# EAGLE design usb-dmx-ftdi (EAGLE 5.11)
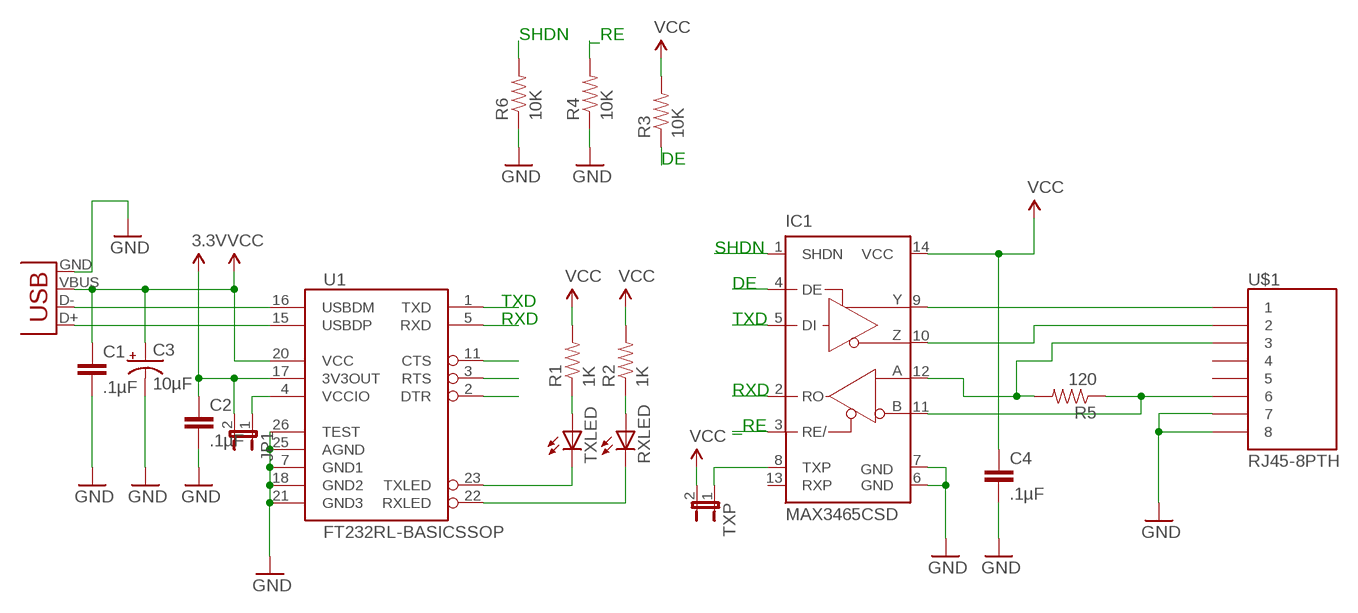
[diagram p0: schematic, sheet 1]

## Parts
C1  .1µF  CAP1206  [1206]
C2  .1µF  CAP1206  [1206]
C3  10µF  CAP_POL1206  [EIA3216]
C4  .1µF  CAP1206  [1206]
IC1  MAX3465CSD  [SO14]
JP1  JUMPER-2PTH  [1X02]
R1  1K  RESISTOR1206  [1206]
R2  1K  RESISTOR1206  [1206]
R3  10K  RESISTOR1206  [1206]
R4  10K  RESISTOR1206  [1206]
R5  120  RESISTOR1206  [1206]
R6  10K  RESISTOR1206  [1206]
RXLED  LEDCHIPLED_1206  [CHIPLED_1206]
TXLED  LEDCHIPLED_1206  [CHIPLED_1206]
TXP  JUMPER-2PTH  [1X02]
U1  FT232RL-BASICSSOP  [SSOP28DB]
U$1  RJ45-8PTH  [RJ45-8]
X1  USBSMD  [USB-MINIB]

## Nets
3.3V: C2.1 JP1.2 U1.17(3V3OUT)
DE: IC1.4(DE) R3.1
GND: C1.2 C2.2 C3.C(-) C4.2 IC1.6(GND) IC1.7(GND) R4.1 R6.1 U1.7(GND1) U1.18(GND2) U1.21(GND3) U1.25(AGND) U1.26(TEST) U$1.7 U$1.8 X1.GND
N$1: U1.16(USBDM) X1.D-
N$2: U1.15(USBDP) X1.D+
N$3: JP1.1 U1.4(VCCIO)
N$4: IC1.12(A) R5.2 U$1.3
N$5: RXLED.C U1.22(RXLED)
N$6: R1.1 TXLED.A
N$7: R2.1 RXLED.A
N$8: IC1.11(B) R5.1 U$1.6
N$9: IC1.9(Y) U$1.1
N$10: IC1.10(Z) U$1.2
N$11: U1.11(CTS)
N$12: U1.3(RTS)
N$13: U1.2(DTR)
N$14: IC1.8(TXP) TXP.1
RE/: IC1.3(RE/) R4.2
RX: TXLED.C U1.23(TXLED)
RXD: IC1.2(RO) U1.5(RXD)
SHDN: IC1.1(SHDN) R6.2
TXD: IC1.5(DI) U1.1(TXD)
VCC: C1.1 C3.A(+) C4.1 IC1.14(VCC) R1.2 R2.2 R3.2 TXP.2 U1.20(VCC) X1.VBUS
Unconnected: IC1.13(RXP) U$1.4 U$1.5

## Notes on the sheet
- SHDN | _RE
- DE
- SHDN
- DE
- TXD
- RXD | TXD
- RXD
- _RE

## Library data of the parts
C1 C2 C4 = SparkFun:CAP: Capacitor Standard 0603 ceramic capacitor, and 0.1" leaded capacitor.
C3 = SparkFun:CAP_POL: Capacitor Polarized These are standard SMD and PTH capacitors. Normally 10uF, 47uF, and 100uF in electrolytic and tantalum varieties. Always verify the external diameter of the through hole cap, it varies with capacity, voltage, and manufacturer. The EIA devices should be standard.
IC1 = maxim:MAX346*: +5V, Fail-Safe, 40Mbps, Profibus RS-485/RS-422 Transceivers Source: MAX3465-MAX3469.pdf
JP1 TXP = SparkFun:JUMPER-2: Jumper Basic 0.1" spaced jumper. Use with breakaway headers.
R1-R6 = SparkFun:RESISTOR: Resistor Basic schematic elements and footprints for 0603, 1206, and PTH resistors.
RXLED TXLED = adafruit:LED: LED OSRAM: - CHIPLED LG R971, LG N971, LY N971, LG Q971, LY Q971, LO R971, LY R971 LH N974, LH R974 LS Q976, LO Q976, LY Q976 LO Q996 - Hyper CHIPLED LW Q18S LB Q993, LB Q99A, LB R99A - SideLED LS A670, LO A670, LY A670, LG A670, LP A670 LB A673, LV A673, LT A673, LW A673 LH A674 LY A675 LS A676, LA A676, LO A676, LY A676, LW A676 LS A679, LY A679, LG A679 - Hyper Micro SIDELED® LS Y876, LA Y876, LO Y876, LY Y876 LT Y87S - SmartLED LW L88C, LW L88S LB L89C, LB L89S, LG L890 LS L89K, LO L89K, LY L89K LS L896, LA L896, LO L896, LY L896 - TOPLED LS T670, LO T670, LY T670, LG T670, LP T670 LSG T670, LSP T670, LSY T670, LOP T670, LYG T670 LG T671, LOG T671, LSG T671 LB T673, LV T673, LT T673, LW T673 LH T674 LS T676, LA T676, LO T676, LY T676, LB T676, LH T676, LSB T676, LW T676 LB T67C, LV T67C, LT T67C, LS T67K, LO T67K, LY T67K, LW E67C LS E67B, LA E67B, LO E67B, LY E67B, LB E67C, LV E67C, LT E67C LW T67C LS T679, LY T679, LG T679 LS T770, LO T770, LY T770, LG T770, LP T770 LB T773, LV T773, LT T773, LW T773 LH T774 LS E675, LA E675, LY E675, LS T675 LS T776, LA T776, LO T776, LY T776, LB T776 LHGB T686 LT T68C, LB T68C - Hyper Mini TOPLED® LB M676 - Mini TOPLED Santana® LG M470 LS M47K, LO M47K, LY M47K Source: http://www.osram.convergy.de/
U1 = SparkFun:FT232RL-BASIC: USB UART This is the simplified version of the FT232RL unit. Only what you need, nothing you don't. Spark Fun Electronics SKU : COM-00650
U$1 = SparkFun:RJ45-8: RJ45 Jack Simple RJ45, 8-pin connection - connector for common Cat5, Cat5e, and Cat6 Ethernet cables. Footprint not yet proven in production. Connector sku is PRT-00643; Breakout PCB sku is BOB-00716.
X1 = SparkFun:USB: USB Connectors USB-B-PTH is fully proven SKU : PRT-00139 USB-miniB is fully proven SKU : PRT-00587 USB-A-PCB is untested. USB-A-H is throughly reviewed, but untested. Spark Fun Electronics SKU : PRT-00437 USB-B-SMT is throughly reviewed, but untested. Needs silkscreen touching up. USB-A-S has not been used/tested USB-MB-H has not been used/tested

## Board
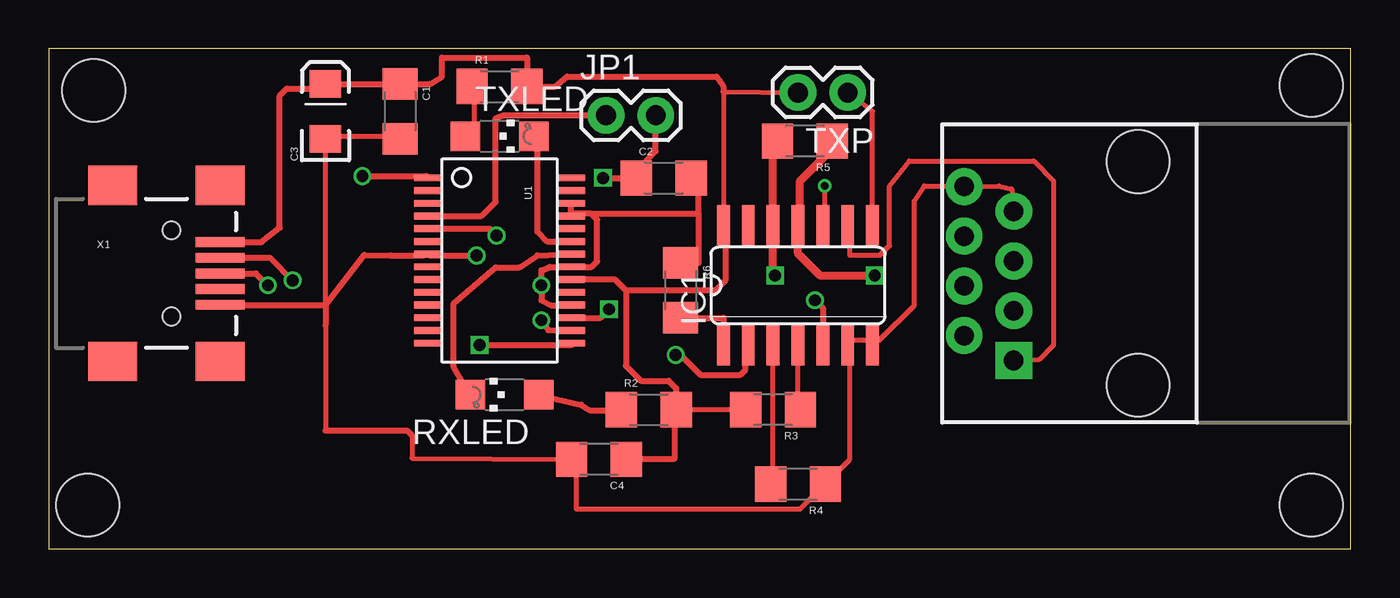
[diagram p1: board, top side]
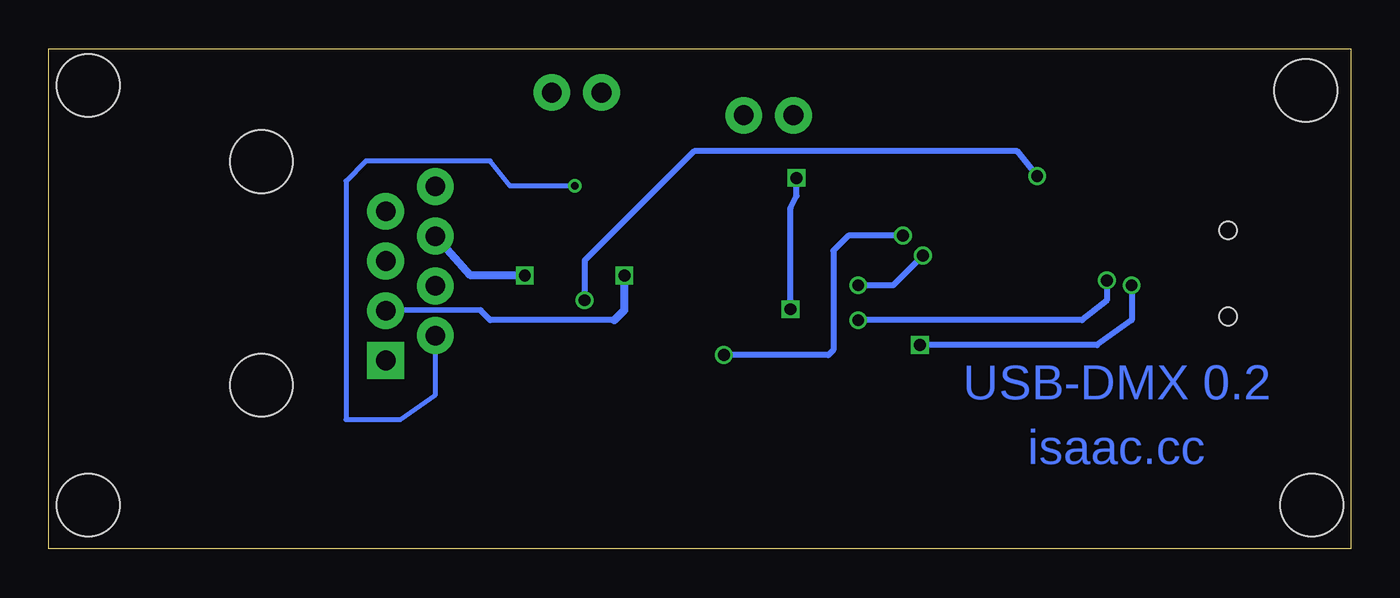
[diagram p2: board, bottom side, seen from below]

Size 66.47 x 25.54 mm. Coordinates in mm from the lower left corner, seen from the top.
Outline: 0,0 66.47,0 66.47,25.54 0,25.54 0,0
Copper layers (1*16): Top 0.035mm / dielectric 1.5mm / Bottom 0.035mm
Design rules "Fusion_eagle_rule_v1.1": minimum track width 6mil, minimum drill 12mil, track to track 6mil, track to pad 6mil, pad to pad 6mil, via to via 6mil, smd to smd 0mil, copper to edge 10mil, drill to drill 10mil, minimum pad ring 10mil, minimum via ring 6mil, stop-mask expansion 2mil, vias tented up to drill 100mil, thermal gap 10mil
Holes 3.2 mm at 1.98,2.24 2.29,23.42 64.47,23.67 64.47,2.24

### Footprints (pad centres in the part's own frame; a part is rotated, then mirrored left to right if it is on the bottom)
1206 = smd 1.6 x 1.8: 1 -1.4,0; 2 1.4,0
EIA3216 = smd 1.4 x 1.6: A 1.4,0; C -1.4,0
SO14 = smd 0.66 x 2.032: 1 -3.81,-3.073; 2 -2.54,-3.073; 3 -1.27,-3.073; 4 0,-3.073; 5 1.27,-3.073; 6 2.54,-3.073; 7 3.81,-3.073; 8 3.81,3.073; 9 2.54,3.073; 10 1.27,3.073; 11 0,3.073; 12 -1.27,3.073; 13 -2.54,3.073; 14 -3.81,3.073
1X02 = drill 1.016 pad 1.88 round: 1 0,0; 2 2.54,0
CHIPLED_1206 = smd 1.5 x 1.5: A 0,-1.75; C 0,1.75
SSOP28DB = smd 0.348 x 1.397: 1 -4.225,-3.656; 2 -3.575,-3.656; 3 -2.925,-3.656; 4 -2.275,-3.656; 5 -1.625,-3.656; 6 -0.975,-3.656; 7 -0.325,-3.656; 8 0.325,-3.656; 9 0.975,-3.656; 10 1.625,-3.656; 11 2.275,-3.656; 12 2.925,-3.656; 13 3.575,-3.656; 14 4.225,-3.656; 15 4.225,3.656; 16 3.575,3.656; 17 2.925,3.656; 18 2.275,3.656; 19 1.625,3.656; 20 0.975,3.656; 21 0.325,3.656; 22 -0.325,3.656; 23 -0.975,3.656; 24 -1.625,3.656; 25 -2.275,3.656; 26 -2.925,3.656; 27 -3.575,3.656; 28 -4.225,3.656
RJ45-8 = drill 1 pad 1.88 square: 1 -4.445,6.35 | drill 1 pad 1.88 round: 2 -3.175,8.89; 3 -1.905,6.35; 4 -0.635,8.89; 5 0.635,6.35; 6 1.905,8.89; 7 3.175,6.35; 8 4.445,8.89 | hole 3.2: -5.715,0; 5.715,0
USB-MINIB = smd 2.5 x 0.5: D+ 2.5,0; D- 2.5,0.8; GND 2.5,-1.6; ID 2.5,-0.8; VBUS 2.5,1.6 | smd 2.5 x 2: MTN1 -3,4.5; MTN2 2.5,4.5; MTN3 -3,-4.5; MTN4 2.5,-4.5 | hole 0.9: 0,2.2; 0,-2.2

### Placement (x,y rotation side)
C1  17.93,22.35 270 top
C2  31.39,18.95 0 top
C3  14.12,22.35 90 top
C4  28.09,4.57 180 top
IC1  38.25,13.46 0 top
JP1  28.45,22.15 0 top
R1  23.01,23.62 0 top
R2  30.63,7.11 0 top
R3  36.98,7.11 180 top
R4  38.25,3.3 180 top
R5  38.61,20.83 180 top
R6  32.26,13.21 270 top
RXLED  23.27,7.87 90 top
TXLED  23.01,21.08 270 top
TXP  40.79,23.32 180 top
U1  23.01,14.73 270 top
U$1  55.63,14.07 90 top
X1  6.25,14.07 0 top

### Tracks (layer width: path | path; a pad name or v marks a point on that pad's centre or on a via)
3.3V  (via drill 0.6)
  Top 0.305: U1.17 28.16,11.81 v28.6,12.24 | v28.3,18.95 C2.1 29.99,19.33 30.99,20.32 JP1.2
  Bottom 0.305: v28.6,12.24 28.6,17.42 28.3,18.03 v28.3,18.95
DE
  Top 0.254: R3.1 38.25,7.11 IC1.4
GND  (via drill 0.6)
  Top 0.254: C1.2 17.93,21.08 14.12,21.08 C3.C 14.12,12.47 | 18.54,5.79 18.54,4.62 C4.2 26.92,4.57 26.92,2.03 38.35,2.03 39.62,3.3 | 14.12,11.43 14.12,6.04 | 39.62,3.3 40.89,4.57 40.89,9.65 IC1.6 40.89,10.67 41.91,10.67 | U$1.7 49.17,18.39 48.51,18.54 U$1.8 46.48,18.54 44.7,18.54 44.2,17.78 44.2,12.45 42.42,10.67 41.91,10.67 | 41.91,10.67 IC1.7 | 39.62,3.3 R4.1
  Top 0.305: X1.GND 14.12,12.47 | 14.12,12.47 14.12,11.43 | 14.12,12.47 16.1,15.01 17.42,14.99 19.1,14.99 U1.7 19.43,14.99 v21.84,14.99 | C2.2 33.17,18.95 33.17,17.12 | 27.69,17.12 26.67,17.12 | 27.69,17.12 33.17,17.12 | 26.67,17.12 U1.25 | 26.67,17.12 U1.26 | 27.69,17.12 27.99,16.82 27.99,14.68 27.72,14.41 U1.21 25.58,14.41 25.15,14.22 v25.15,13.46 25.15,12.7 25.65,12.45 26.66,12.45 U1.18 | 14.12,6.04 18.29,6.04 18.54,5.79 | R6.1 33.17,14.61 33.17,17.12
  Bottom 0.305: v25.15,13.46 23.37,13.46 v21.84,14.99
N$1  (via drill 0.6)
  Top 0.305: U1.16 25.5,11.18 v25.15,11.68 | X1.D- 11.29,14.87 v12.45,13.72
  Bottom 0.305: v12.45,13.72 12.45,12.7 13.72,11.68 v25.15,11.68
N$2  (via drill 0.6)
  Top 0.305: v22,10.41 26.67,10.41 U1.15 | X1.D+ 10.57,14.07 v11.18,13.46
  Bottom 0.305: v11.18,13.46 11.18,11.68 12.95,10.41 v22,10.41
N$3
  Top 0.305: JP1.1 23.22,22.15 22.81,22 22.81,17.73 22.09,17.01 U1.4
N$4  (via drill 0.6)
  Top 0.406: R5.2 36.98,20.83 IC1.12 36.98,14.07 v37.08,13.97
  Bottom 0.305: 37.59,11.68 43.94,11.68 44.45,12.19 44.42,12.19 U$1.3
  Bottom 0.406: v37.08,13.97 37.08,12.19 37.59,11.68
N$5
  Top 0.305: U1.22 24.94,14.99 24.03,14.38 22.81,14.38 20.68,12.55 20.68,9.3 RXLED.C
N$6
  Top 0.254: TXLED.A 21.74,21.08 21.74,23.62 R1.1
N$7
  Top 0.305: RXLED.A 27.18,7.37 27.64,7.06 29.18,7.06 R2.1
N$8  (via drill 0.6)
  Top 0.406: R5.1 40.01,20.45 38.35,18.8 38.35,16.64 IC1.11 38.25,15.09 39.37,13.97 v42.16,13.97
  Bottom 0.406: v42.16,13.97 44.93,13.97 U$1.6
N$9
  Top 0.254: IC1.9 40.89,16 40.89,14.99 42.42,14.99 42.93,15.49 42.93,18.54 43.94,19.81 50.29,19.81 51.31,18.8 51.31,10.41 50.55,9.65 U$1.1
N$10  (via drill 0.38)
  Top 0.254: v39.62,18.54 39.62,17.27 IC1.10
  Bottom 0.254: v39.62,18.54 42.93,18.54 43.94,19.81 50.29,19.81 51.31,18.8 51.31,6.6 48.51,6.6 46.74,7.87 U$1.2
N$14
  Top 0.254: TXP.1 42.06,22.35 IC1.8
RE/
  Top 0.254: R4.2 36.98,3.3 IC1.3
RX
  Top 0.305: TXLED.C 24.94,21.08 24.94,16.2 25.44,15.71 U1.23
RXD  (via drill 0.6)
  Top 0.305: U1.5 22.5,16.36 v22.86,16 | v32,9.91 32.26,9.91 33.27,8.89 35.31,8.89 35.56,9.14 35.56,10.24 IC1.2
  Bottom 0.305: v22.86,16 25.65,16 26.42,15.24 26.42,10.16 26.67,9.91 v32,9.91
SHDN
  Top 0.305: R6.2 34.44,11.81 IC1.1
TXD  (via drill 0.6)
  Top 0.305: IC1.5 39.52,12.29 v39.12,12.7 | v16,19.05 19.26,19.05 U1.1
  Bottom 0.305: v39.12,12.7 39.12,14.73 33.53,20.32 17.02,20.32 v16,19.05
VCC
  Top 0.254: TXP.2 34.44,23.37 IC1.14 | 35.81,7.11 R3.2 R2.2 32,7.11
  Top 0.305: 34.44,16.2 IC1.14 34.54,16.43 34.54,13.72 34.04,13.21 29.46,13.21 | 34.44,23.37 34.44,23.62 34.09,24.13 26.47,24.13 25.86,23.62 R1.2 24.41,25.09 20.07,25.09 20.07,24.13 19.46,23.75 C1.1 C3.A 13.89,23.52 12.14,23.52 11.79,23.16 11.79,16.41 10.85,15.67 X1.VBUS | C4.1 31.9,4.57 31.95,4.62 31.95,7.03 R2.2 32.03,8.2 31.65,8.59 30.23,8.59 29.46,9.35 29.46,13.21 | U1.20 28.91,13.76 29.46,13.21

### Text on the board
Bottom: USB-DMX 0.2 | isaac.cc